# Altium schematic sheet Output buffer C and D. Page 3.SchDoc
size 420 x 297 mm; Address1: Address1; Address2: Address2; Address3: Address3; Address4: Address4; DocumentNumber: АБВГ.123456.001 Э3; SheetNumber: 3; SheetTotal: 5; Scale: 1:1; DocumentType: Схема электрическая принципиальная; FirstReferrence: АБВГ.123456.001
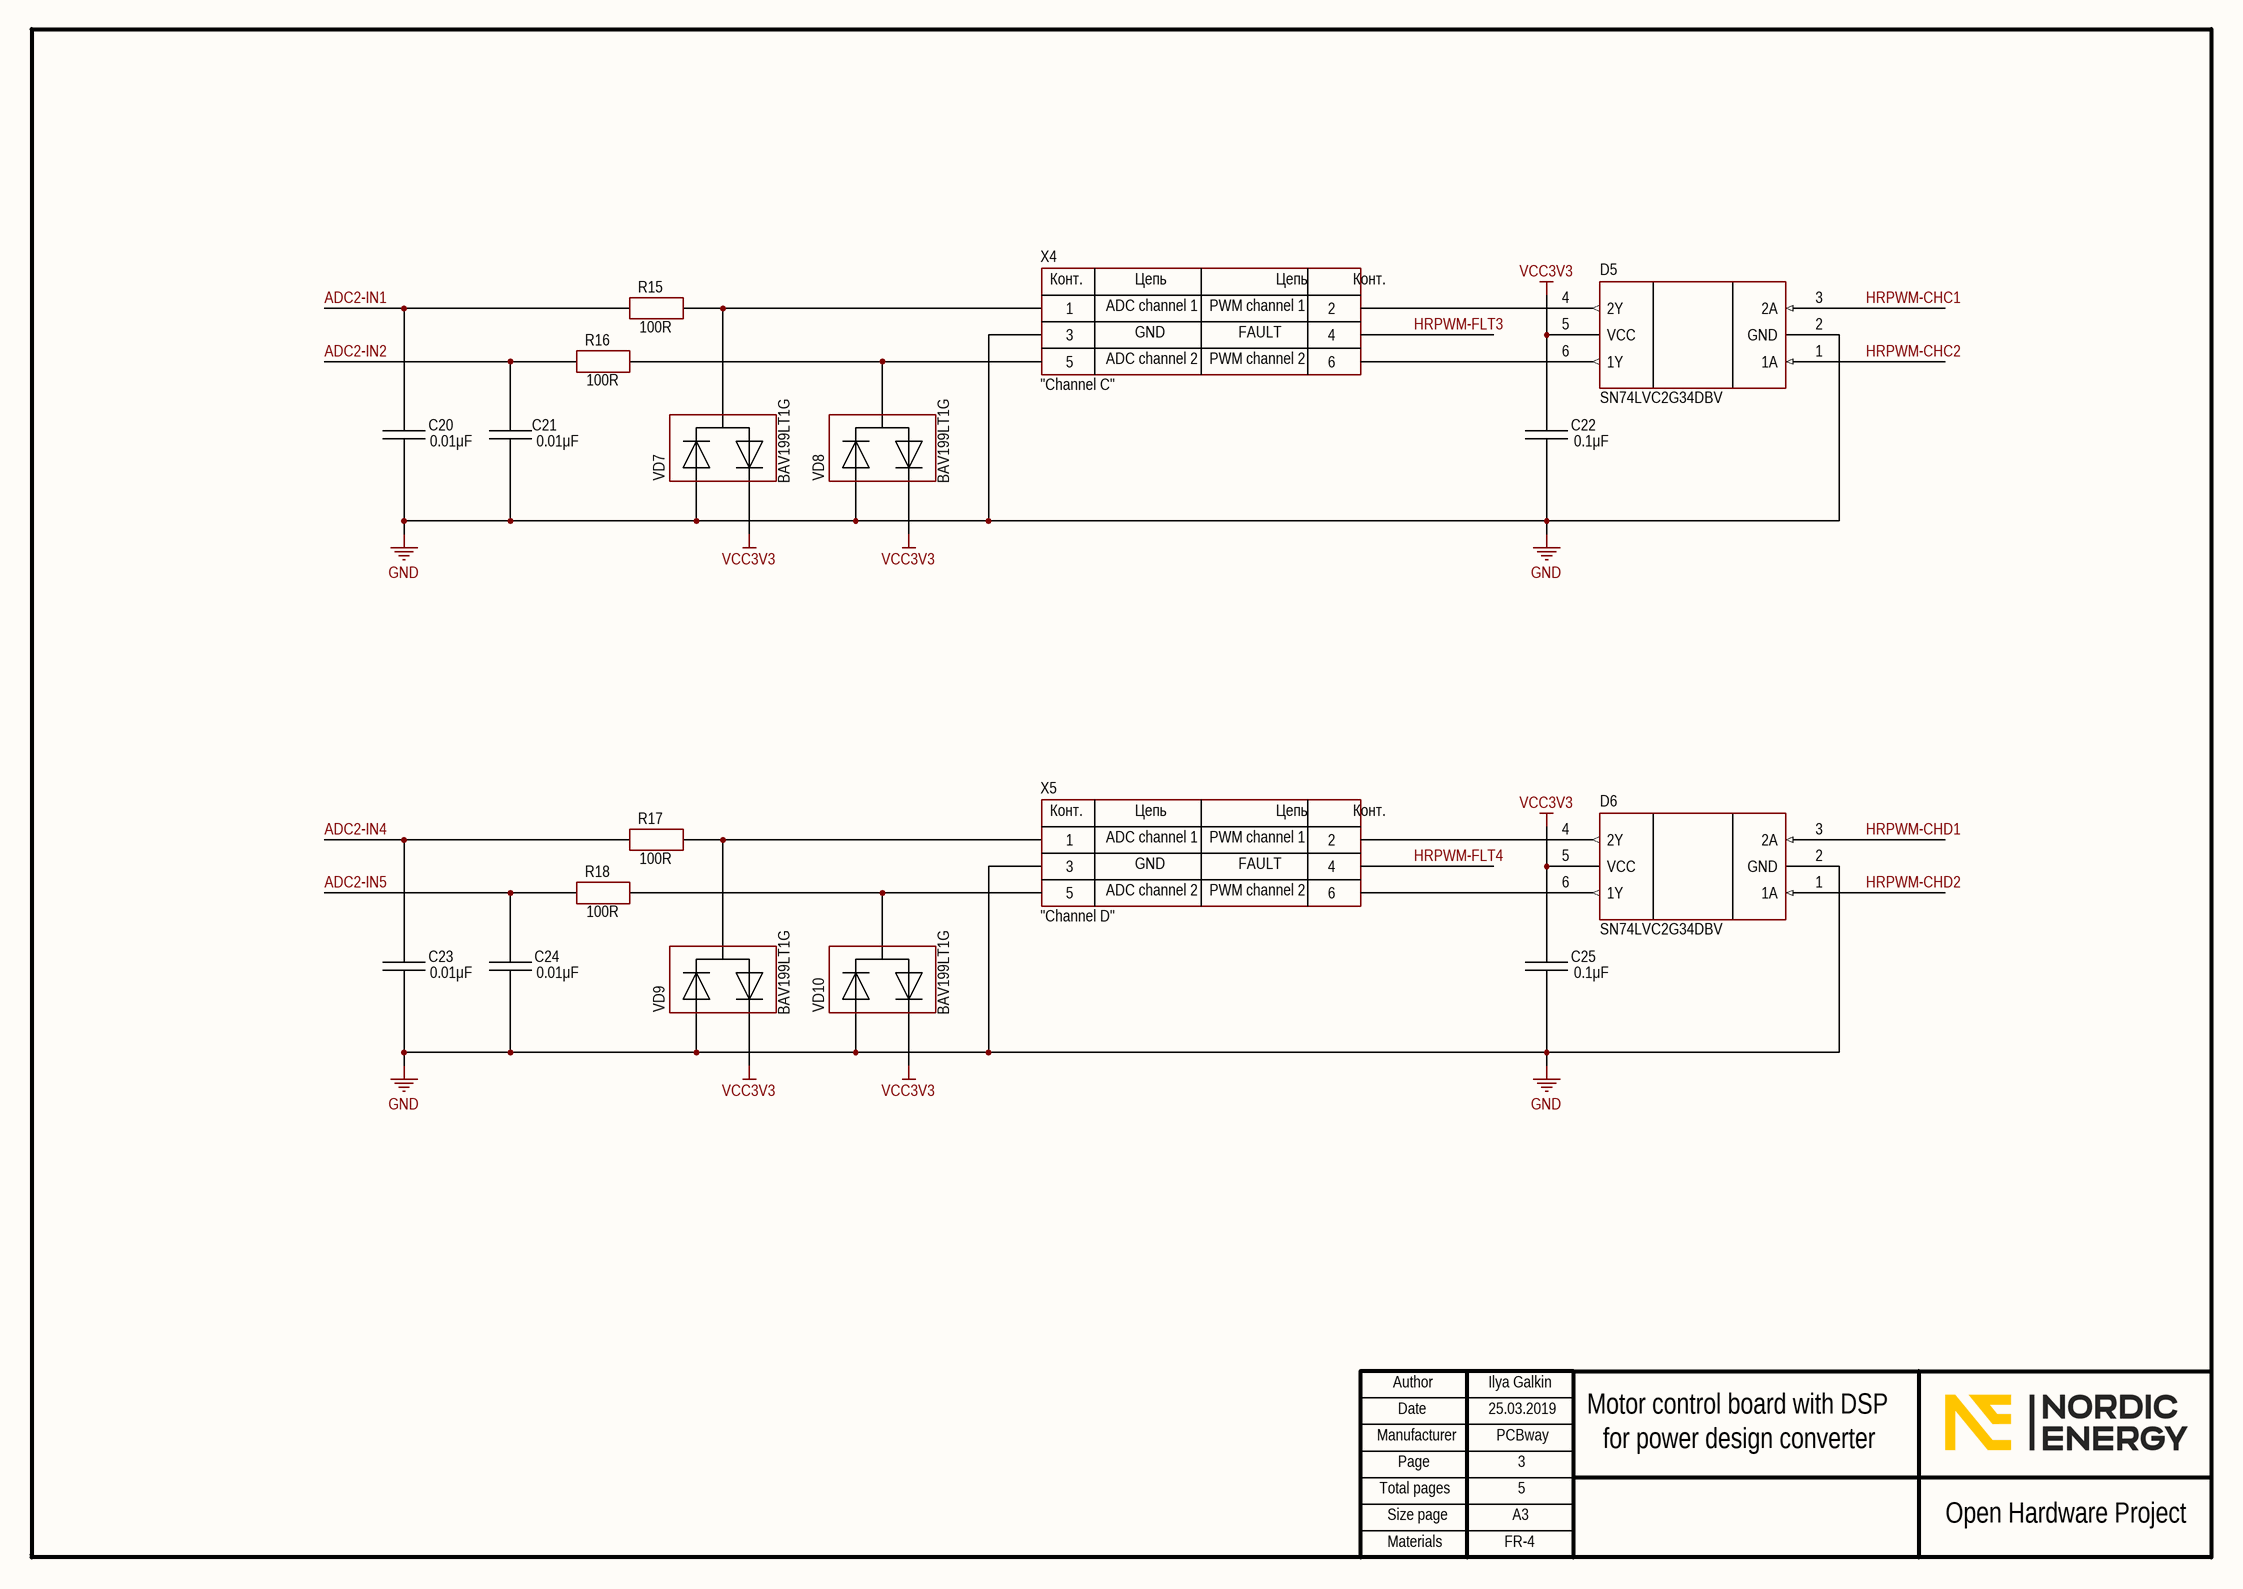
[diagram p0: Output buffer C and D. Page 3.SchDoc]

## Parts
C20  0.01μF  [CH0805C]
C21  0.01μF  [CH0805C]
C22  0.1μF  [CH0805C]
C23  0.01μF  [CH0805C]
C24  0.01μF  [CH0805C]
C25  0.1μF  [CH0805C]
D5  SN74LVC2G34DBV  [SOT23-6]
D6  SN74LVC2G34DBV  [SOT23-6]
R15  100R  [CH0805R]
R16  100R  [CH0805R]
R17  100R  [CH0805R]
R18  100R  [CH0805R]
VD7  BAV199LT1G  [SOT23_132]
VD8  BAV199LT1G  [SOT23_132]
VD9  BAV199LT1G  [SOT23_132]
VD10  BAV199LT1G  [SOT23_132]
X4  "Channel C"  [CON: PLD-6]
X5  "Channel D"  [CON: PLD-6]

## Nets
GND: C20.1 C21.1 C22.1 C23.1 C24.1 C25.1 D5.2(GND) D6.2(GND) VD7.1 VD8.1 VD9.1 VD10.1 X4.3 X5.3
VCC3V3: C22.2 C25.2 D5.5(VCC) D6.5(VCC) VD7.2 VD8.2 VD9.2 VD10.2
ADC2-IN1: C20.2 R15.1
ADC2-IN2: C21.2 R16.1
ADC2-IN4: C23.2 R17.1
ADC2-IN5: C24.2 R18.1
HRPWM-CHC1: D5.3(2A)
HRPWM-CHC2: D5.1(1A)
HRPWM-CHD1: D6.3(2A)
HRPWM-CHD2: D6.1(1A)
HRPWM-FLT3: X4.4
HRPWM-FLT4: X5.4
NetD5_4: D5.4(2Y) X4.2
NetD5_6: D5.6(1Y) X4.6
NetD6_4: D6.4(2Y) X5.2
NetD6_6: D6.6(1Y) X5.6
NetR15_2: R15.2 VD7.3 X4.1
NetR16_2: R16.2 VD8.3 X4.5
NetR17_2: R17.2 VD9.3 X5.1
NetR18_2: R18.2 VD10.3 X5.5

## Notes on the sheet
- (near X4) ADC channel 1
- (near X4) PWM channel 1
- (near X4) ADC channel 2
- (near X4) GND
- (near X4) PWM channel 2
- (near X4) FAULT
- (near X5) ADC channel 1
- (near X5) GND
- (near X5) PWM channel 1
- (near X5) FAULT
- (near X5) ADC channel 2
- (near X5) PWM channel 2
- Ilya Galkin
- 25.03.2019
- PCBway
- 3
- Motor control board with DSP
- for power design converter
- 5
- FR-4
- Author
- Manufacturer
- Date
- Page
- Total pages
- Size page
- A3
- Open Hardware Project
- Materials
- (in symbol 6(2)-Connector) Конт.; Цепь

## Library data of the parts
C20 C21 C23 C24 = Capacitor: Manufacturer: Yageo; Model: CC0805KRX7R9BB103; HelpURL: https://www.digikey.com/product-detail/en/yageo/CC0805KRX7R9BB103/311-1136-1-ND/303046; ComponentKind: X7R; Value: 0.01μF
C22 C25 = Capacitor: Manufacturer: Yageo; Model: CC0805KRX7R7BB104; HelpURL: https://www.digikey.com/product-detail/en/yageo/CC0805KRX7R7BB104/311-1142-1-ND/303052; ComponentKind: X7R; Value: 0.1μF
D5 D6 = SN74LVC2G34DBV: Buffer; Manufacturer: Texas Instruments; Model: SN74LVC2G34DBV; HelpURL: https://www.digikey.com/product-detail/en/texas-instruments/SN74LVC2G34DBVR/296-13496-1-ND/486431; ComponentKind: SOT-23-6
R15-R18 = Resistor: Manufacturer: Yageo; Model: RC0805JR-07100RL; HelpURL: https://www.digikey.com/product-detail/en/yageo/RC0805JR-07100RL/311-100ARCT-ND/731185; ComponentKind: ±5%; Value: 100R
VD7-VD10 = Diod Array: Manufacturer: ON Semiconductor; ComponentKind: 70V; Model: BAV199LT1G; HelpURL: https://www.digikey.com/product-detail/en/on-semiconductor/BAV199LT1G/BAV199LT1GOSCT-ND/917816
X4 X5 = 6(2)-Connector: Model: *; Manufacturer: *; HelpURL: *; ComponentKind: *